# Altium project AD9763.PrjPcb
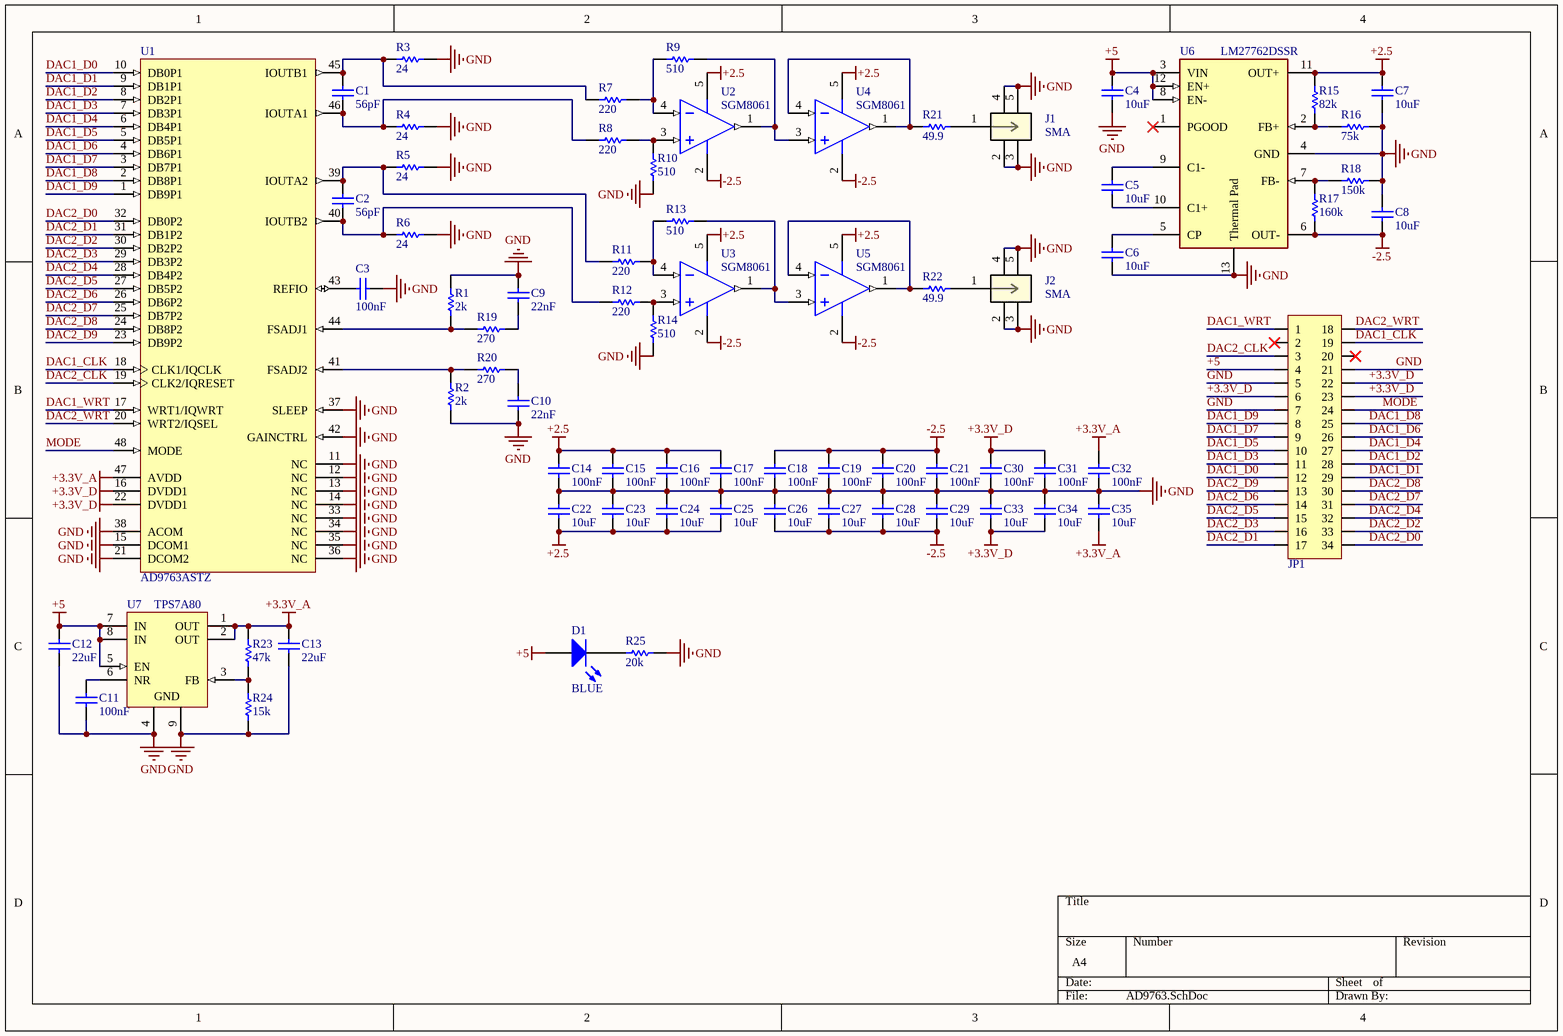
[diagram p0: AD9763.SchDoc]
1 sheet, 71 parts. Net scope: global (net labels, ports and power ports of the same name join across sheets).
Board file: AD9763.PcbDoc

## Sheet AD9763.SchDoc
size A4; SheetNumber: 1; SheetTotal: 1; SPICEModelCacheSEDAMOED: <root> / <DocumentId>SEDAMOED</DocumentId> / <CacheFrame Number="0"> / <Model Name="led0" Kind="MDL"> / <Text>*Typ INFRARED GaAs LED: Vf=1.2V Vr=5V If=40mA trr=3uS / *LED Pinout: 1=A, 2=K / .MODEL LED0 D (IS=93.5P RS=84M N=2.63 BV=5 IBV=10U / + CJO=2.97P VJ=.75 M=.333 TT=4.32U)</Text> / </Model> / </CacheFrame> / </root>

### Parts
C1  56pF  [C 0402_L]
C2  56pF  [C 0402_L]
C3  100nF  [C 0402_L]
C4  10uF  [C 0402_L]
C5  10uF  [C 0402_L]
C6  10uF  [C 0402_L]
C7  10uF  [C 0402_L]
C8  10uF  [C 0402_L]
C9  22nF  [C 0402_L]
C10  22nF  [C 0402_L]
C11  100nF  [C 0402_L]
C12  22uF  [0805_C]
C13  22uF  [0805_C]
C14  100nF  [C 0402_L]
C15  100nF  [C 0402_L]
C16  100nF  [C 0402_L]
C17  100nF  [C 0402_L]
C18  100nF  [C 0402_L]
C19  100nF  [C 0402_L]
C20  100nF  [C 0402_L]
C21  100nF  [C 0402_L]
C22  10uF  [C 0402_L]
C23  10uF  [C 0402_L]
C24  10uF  [C 0402_L]
C25  10uF  [C 0402_L]
C26  10uF  [C 0402_L]
C27  10uF  [C 0402_L]
C28  10uF  [C 0402_L]
C29  10uF  [C 0402_L]
C30  100nF  [C 0402_L]
C31  100nF  [C 0402_L]
C32  100nF  [C 0402_L]
C33  10uF  [C 0402_L]
C34  10uF  [C 0402_L]
C35  10uF  [C 0402_L]
D1  BLUE  [LED 0603B]
J1  SMA  [CONN_132414_AMP]
J2  SMA  [CONN_132414_AMP]
JP1  Header_2x17P  [HDR2.54_2x17P]  (value not drawn)
R1  2k  [R 0402_L]
R2  2k  [R 0402_L]
R3  24  [R 0402_L]
R4  24  [R 0402_L]
R5  24  [R 0402_L]
R6  24  [R 0402_L]
R7  220  [R 0402_L]
R8  220  [R 0402_L]
R9  510  [R 0402_L]
R10  510  [R 0402_L]
R11  220  [R 0402_L]
R12  220  [R 0402_L]
R13  510  [R 0402_L]
R14  510  [R 0402_L]
R15  82k  [R 0402_L]
R16  75k  [R 0402_L]
R17  160k  [R 0402_L]
R18  150k  [R 0402_L]
R19  270  [R 0402_L]
R20  270  [R 0402_L]
R21  49.9  [R 0402_L]
R22  49.9  [R 0402_L]
R23  47k  [R 0402_L]
R24  15k  [R 0402_L]
R25  20k  [R 0402_L]
U1  AD9763ASTZ  [ST-48_L]
U2  SGM8061  [SOT-23-5]
U3  SGM8061  [SOT-23-5]
U4  SGM8061  [SOT-23-5]
U5  SGM8061  [SOT-23-5]
U6  LM27762DSSR  [FP-DSS0012B-MFG]
U7  TPS7A80  [DRB0008A_V]

### Nets
+2.5: C7.2 C14.2 C15.2 C16.2 C17.2 C22.1 C23.1 C24.1 C25.1 R15.2 U2.5(VS+) U3.5(VS+) U4.5(VS+) U5.5(VS+) U6.11(OUT+)
+3.3V_A: C13.2 C32.2 C35.1 R23.1 U1.47(AVDD) U7.1(OUT) U7.2(OUT)
+3.3V_D: C30.2 C31.2 C33.1 C34.1 JP1.6 JP1.22 JP1.23 U1.16(DVDD1) U1.22(DVDD1)
+5: C4.2 C12.2 D1.1(A) JP1.4 U6.3(VIN) U6.8(EN-) U6.12(EN+) U7.5(EN) U7.7(IN) U7.8(IN)
-2.5: C8.1 C18.2 C19.2 C20.2 C21.2 C26.1 C27.1 C28.1 C29.1 R17.1 U2.2(VS-) U3.2(VS-) U4.2(VS-) U5.2(VS-) U6.6(OUT-)
GND: C3.2 C4.1 C6.1 C7.1 C8.2 C9.2 C10.1 C11.1 C12.1 C13.1 C14.1 C15.1 C16.1 C17.1 C18.1 C19.1 C20.1 C21.1 C22.2 C23.2 C24.2 C25.2 C26.2 C27.2 C28.2 C29.2 C30.1 C31.1 C32.1 C33.2 C34.2 C35.2 J1.2 J1.3 J1.4 J1.5 J2.2 J2.3 J2.4 J2.5 JP1.5 JP1.7 JP1.21 R1.2 R2.2 R3.2 R4.2 R5.2 R6.2 R10.1 R14.1 R16.1 R18.1 R24.2 R25.2 U1.11(NC) U1.12(NC) U1.13(NC) U1.14(NC) U1.15(DCOM1) U1.21(DCOM2) U1.33(NC) U1.34(NC) U1.35(NC) U1.36(NC) U1.37(SLEEP) U1.38(ACOM) U1.42(GAINCTRL) U6.4(GND) U6.13(Thermal_Pad) U7.4(GND) U7.9(GND)
DAC1_CLK: JP1.19 U1.18(CLK1/IQCLK)
DAC1_D0: JP1.12 U1.10(DB0P1)
DAC1_D1: JP1.29 U1.9(DB1P1)
DAC1_D2: JP1.28 U1.8(DB2P1)
DAC1_D3: JP1.11 U1.7(DB3P1)
DAC1_D4: JP1.27 U1.6(DB4P1)
DAC1_D5: JP1.10 U1.5(DB5P1)
DAC1_D6: JP1.26 U1.4(DB6P1)
DAC1_D7: JP1.9 U1.3(DB7P1)
DAC1_D8: JP1.25 U1.2(DB8P1)
DAC1_D9: JP1.8 U1.1(DB9P1)
DAC1_WRT: JP1.1 U1.17(WRT1/IQWRT)
DAC2_CLK: JP1.3 U1.19(CLK2/IQRESET)
DAC2_D0: JP1.34 U1.32(DB0P2)
DAC2_D1: JP1.17 U1.31(DB1P2)
DAC2_D2: JP1.33 U1.30(DB2P2)
DAC2_D3: JP1.16 U1.29(DB3P2)
DAC2_D4: JP1.32 U1.28(DB4P2)
DAC2_D5: JP1.15 U1.27(DB5P2)
DAC2_D6: JP1.14 U1.26(DB6P2)
DAC2_D7: JP1.31 U1.25(DB7P2)
DAC2_D8: JP1.30 U1.24(DB8P2)
DAC2_D9: JP1.13 U1.23(DB9P2)
DAC2_WRT: JP1.18 U1.20(WRT2/IQSEL)
MODE: JP1.24 U1.48(MODE)
NetC1_1: C1.1 R4.1 R8.1 U1.46(IOUTA1)
NetC1_2: C1.2 R3.1 R7.1 U1.45(IOUTB1)
NetC2_1: C2.1 R6.1 R12.1 U1.40(IOUTB2)
NetC2_2: C2.2 R5.1 R11.1 U1.39(IOUTA2)
NetC3_1: C3.1 U1.43(REFIO)
NetC5_1: C5.1 U6.10(C1+)
NetC5_2: C5.2 U6.9(C1-)
NetC6_2: C6.2 U6.5(CP)
NetC9_1: C9.1 R19.1
NetC10_2: C10.2 R20.1
NetC11_2: C11.2 U7.6(NR)
NetD1_2: D1.2(K) R25.1
NetJ1_1: J1.1 R21.1
NetJ2_1: J2.1 R22.1
NetR1_1: R1.1 R19.2 U1.44(FSADJ1)
NetR2_1: R2.1 R20.2 U1.41(FSADJ2)
NetR7_2: R7.2 R9.1 U2.4(IN-)
NetR8_2: R8.2 R10.2 U2.3(IN+)
NetR9_2: R9.2 U2.1(OUT) U4.3(IN+)
NetR11_2: R11.2 R13.1 U3.4(IN-)
NetR12_2: R12.2 R14.2 U3.3(IN+)
NetR13_2: R13.2 U3.1(OUT) U5.3(IN+)
NetR15_1: R15.1 R16.2 U6.2(FB+)
NetR17_2: R17.2 R18.2 U6.7(FB-)
NetR21_2: R21.2 U4.1(OUT) U4.4(IN-)
NetR22_2: R22.2 U5.1(OUT) U5.4(IN-)
NetR23_2: R23.2 R24.1 U7.3(FB)

Not connected (* = marked no-connect by the designer): JP1 2* 20*; U6 1(PGOOD)*

### Library data of the parts
C1-C3 C9-C21 C30-C32 = Cap: Capacitor; Value: 10uF; Published: 8-Jun-2000; LatestRevisionDate: 17-Jul-2002; LatestRevisionNote: Re-released for DXP Platform.; PackageReference: RAD-0.3; Publisher: Altium Limited; PackageDescription: Radial Cap, Thru-Hole; 2 Leads; 0.3 in Pin Spacing
C4-C8 C22-C29 C33-C35 = Cap: Capacitor; Published: 8-Jun-2000; LatestRevisionDate: 17-Jul-2002; LatestRevisionNote: Re-released for DXP Platform.; PackageReference: RAD-0.3; Publisher: Altium Limited; PackageDescription: Radial Cap, Thru-Hole; 2 Leads; 0.3 in Pin Spacing; Value: 10uF
D1 = LED0: Typical INFRARED GaAs LED; Published: 8-Jun-2000; LatestRevisionDate: 08-Jul-2005; LatestRevisionNote: Mech Layer 1 removed.; PackageReference: LED-0; Publisher: Altium Limited; PackageDescription: LED; 2 Leads
J1 J2 = 132414: No Description Available; Mfr_Name: Amphenol ICC; Copyright: Copyright (C) 2022 Ultra Librarian. All rights reserved.; Manufacturer_Part_Number: 132414; RefDes: RefDes; Type: DEV
R1-R25 = Res1: Resistor; Value: 43K; Published: 8-Jun-2000; LatestRevisionDate: 17-Jul-2002; LatestRevisionNote: Re-released for DXP Platform.; PackageReference: AXIAL-0.3; Publisher: Altium Limited; PackageDescription: Axial Device, Thru-Hole; 2 Leads; 0.3 in Pin Spacing
U1 = CMP-0318-00749-2: Dual 10-Bit TxDAC+, 125 Msps, -40 to +85 degC, ST-48, Pb-Free, Tray; Manufacturer: Analog Devices; Generic Part Number: AD9763; Settling Time: 35ns; # DAC Outputs: 2; Resolution (Bits): 10; Max V+: 5.5V; Single Supply: Yes; Op Pwr Diss: 450mW; PackageDescription: 48-Pin Thin Quad Flat Pack 0.5 mm Pitch; ComponentLink4URL: http://www.analog.com/en/digital-to-analog-converters/da-converters/ad9763/products/product.html; ComponentLink1Description: Manufacturer URL; RevisionNote: Component URL fixed; ComponentLink1URL: http://www.analog.com/en/index.html; PackageVersion: revA; Mounting Technology: Surface Mount; ComponentLink3URL: http://www.analog.com/static/imported-files/packages/PKG_PDF/LQFP%28ST%29/ST_48.pdf; RoHS: Y; ComponentLink3Description: Package Specification; PartNumber: AD9763ASTZ; DatasheetVersion: Rev.G; ComponentLink4Description: Product URL; ComponentLink2URL: http://www.analog.com/static/imported-files/data_sheets/AD9763_9765_9767.pdf; ComponentLink2Description: Datasheet; Packing: Tray; PackageReference: ST-48
U2-U5 = SGM8061: 500 MHz Unity Gain Stable Amplifier, 2.5 to 5.5 V, -40 to 85 degC, 5-pin SOT23, Green (RoHS & no Sb/Br)
U6 = CMP-04918-000139-2: IC REG CHARGE PUMP ADJ DL 12WSON; Min Output Voltage: 1.5V; Max Input Voltage: 5.5V; Synchronous Rectifier: No; Output Type: Adjustable; Output Current: 250mA; Min Input Voltage: 2.7V; Quiescent Current: 390uA; Switching Frequency: 2.3MHz; Max Output Voltage: 5V; Topology: Charge Pump; Lead Free: Lead Free; Min Operating Temperature: -40°C; Max Operating Temperature: 85°C; RoHS Compliant: Yes; Packaging: Tape and Reel; Mount: Surface Mount
U7 = CMP-0395-00599-2: Single Output LDO, 1 A, Adjustable 0.8 to 6 V Output, 2.2 to 6.5 V Input, with High-Bandwidth PSRR, 8-pin SON (DRB), -40 to 125 degC, Green (RoHS & no Sb/Br); PartNumber: TPS7A8001DRBR; Manufacturer: Texas Instruments; Iout(Max)(A): 1; Vin(Max)(V): 6.5; SubFamily: Single Channel LDO; Vdo(Typ)(mV): 170; Vout Adj(Min)(V): 0.8; Vin(Min)(V): 2.2; Accuracy(%): 3; Iq(Typ)(mA): 0.04; Vout Adj(Max)(V): 6; DatasheetVersion: SBVS135G; ComponentLink1Description: Manufacturer URL; ComponentLink1URL: http://www.ti.com/; Eco-Plan: Green (RoHS & no Sb/Br); PackageVersion: 4203482-2/K; PackageReference: DRB0008A; ComponentLink3Description: Package Specification; PackageDescription: 8-Pin Plastic Small Outline, Body 3 x 3 mm, Pitch 0.65 mm; ComponentLink2URL: http://www.ti.com/general/docs/lit/getliterature.tsp?genericPartNumber=TPS7A8001&fileType=pdf; ComponentLink2Description: Datasheet; Mounting Technology: Surface Mount; ComponentLink3URL: http://www.ti.com/litv/pdf/mpds118h